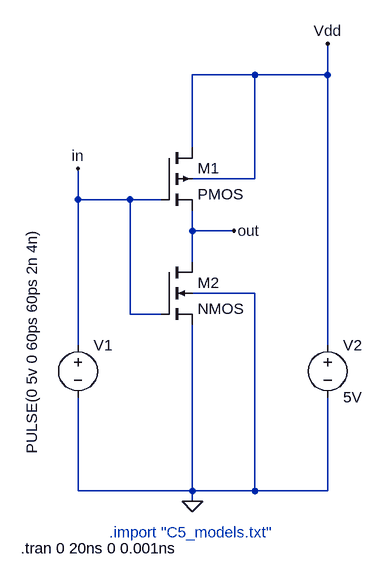
[diagram p0: schematic NOT.asc]
NOT.asc, the LTspice schematic file:
Version 4
SHEET 1 880 680
WIRE 416 -448 320 -448
WIRE 528 -448 528 -496
WIRE 528 -448 416 -448
WIRE 320 -336 320 -448
WIRE 416 -288 416 -448
WIRE 416 -288 320 -288
WIRE 144 -256 144 -304
WIRE 224 -256 144 -256
WIRE 272 -256 224 -256
WIRE 320 -208 320 -240
WIRE 384 -208 320 -208
WIRE 320 -160 320 -208
WIRE 416 -112 320 -112
WIRE 224 -80 224 -256
WIRE 272 -80 224 -80
WIRE 144 -32 144 -256
WIRE 528 -32 528 -448
WIRE 144 192 144 48
WIRE 320 192 320 -64
WIRE 320 192 144 192
WIRE 416 192 416 -112
WIRE 416 192 320 192
WIRE 528 192 528 48
WIRE 528 192 416 192
WIRE 320 208 320 192
FLAG 320 208 0
FLAG 144 -304 in
FLAG 528 -496 Vdd
FLAG 384 -208 out
SYMBOL voltage 144 -48 R0
WINDOW 3 -71 -163 VRight 2
WINDOW 123 0 0 Left 0
WINDOW 39 0 0 Left 0
SYMATTR Value PULSE(0 5v 0 60ps 60ps 2n 4n)
SYMATTR InstName V1
SYMBOL voltage 528 -48 R0
WINDOW 123 0 0 Left 0
WINDOW 39 0 0 Left 0
SYMATTR InstName V2
SYMATTR Value 5V
SYMBOL pmos4 272 -336 R0
SYMATTR InstName M1
SYMATTR Value2 l=0.6u w=6u
SYMBOL nmos4 272 -160 R0
SYMATTR InstName M2
SYMATTR Value2 l=0.6u w=3u
TEXT 192 256 Left 2 ;.import "C5_models.txt"
TEXT 56 280 Left 2 !.tran 0 20ns 0 0.001ns

The netlist it stands for:
* NOT.asc
V1 in 0 PULSE(0 5v 0 60ps 60ps 2n 4n)
V2 Vdd 0 5V
M1 Vdd in out Vdd PMOS l=0.6u w=6u
M2 out in 0 0 NMOS l=0.6u w=3u
.model NMOS NMOS
.model PMOS PMOS
.lib standard.mos
* .import "C5_models.txt"
.tran 0 20ns 0 0.001ns
.backanno
.end